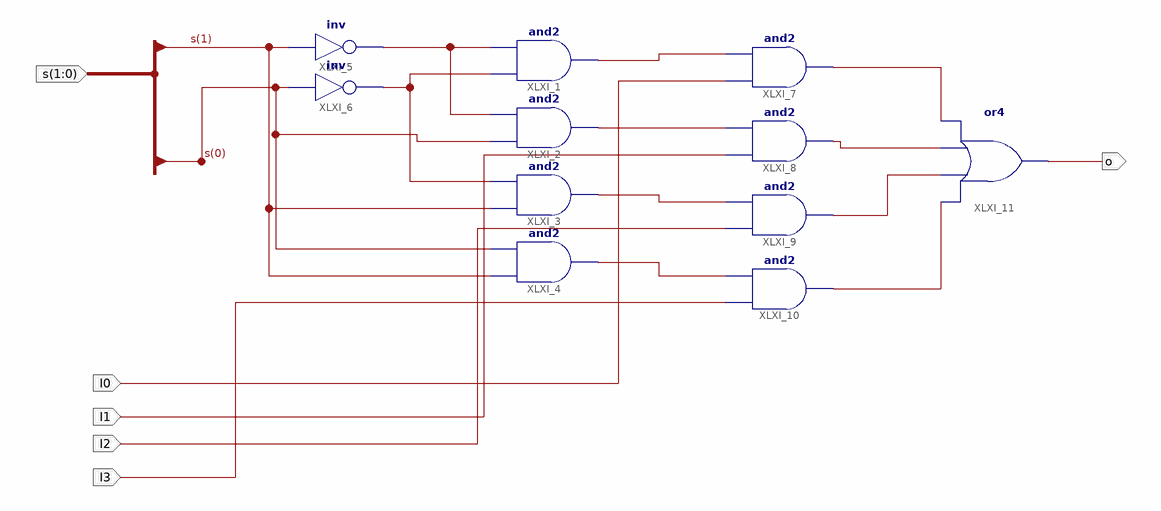
[diagram p0: schematic sheet 1]
// Xilinx ISE schematic Mux4to1_sch.sch (kintex7) as structural Verilog: 11 symbols, 6 ports
module Mux4to1_sch (
  input  [1:0] s,
  input  I0,
  input  I1,
  input  I2,
  input  I3,
  output o
);

  wire XLXN_7, XLXN_8, XLXN_24, XLXN_25, XLXN_26, XLXN_27, XLXN_29, XLXN_30, XLXN_31, XLXN_32;

  and XLXI_1 (XLXN_24, XLXN_8, XLXN_7);
  and XLXI_2 (XLXN_25, s[0], XLXN_7);
  and XLXI_3 (XLXN_26, s[1], XLXN_8);
  and XLXI_4 (XLXN_27, s[1], s[0]);
  not XLXI_5 (XLXN_7, s[1]);
  not XLXI_6 (XLXN_8, s[0]);
  and XLXI_7 (XLXN_29, I0, XLXN_24);
  and XLXI_8 (XLXN_30, I1, XLXN_25);
  and XLXI_9 (XLXN_31, I2, XLXN_26);
  and XLXI_10 (XLXN_32, I3, XLXN_27);
  or XLXI_11 (o, XLXN_32, XLXN_31, XLXN_30, XLXN_29);
endmodule
